# EAGLE schematic ISE2024 kibann (EAGLE 9.6.2)
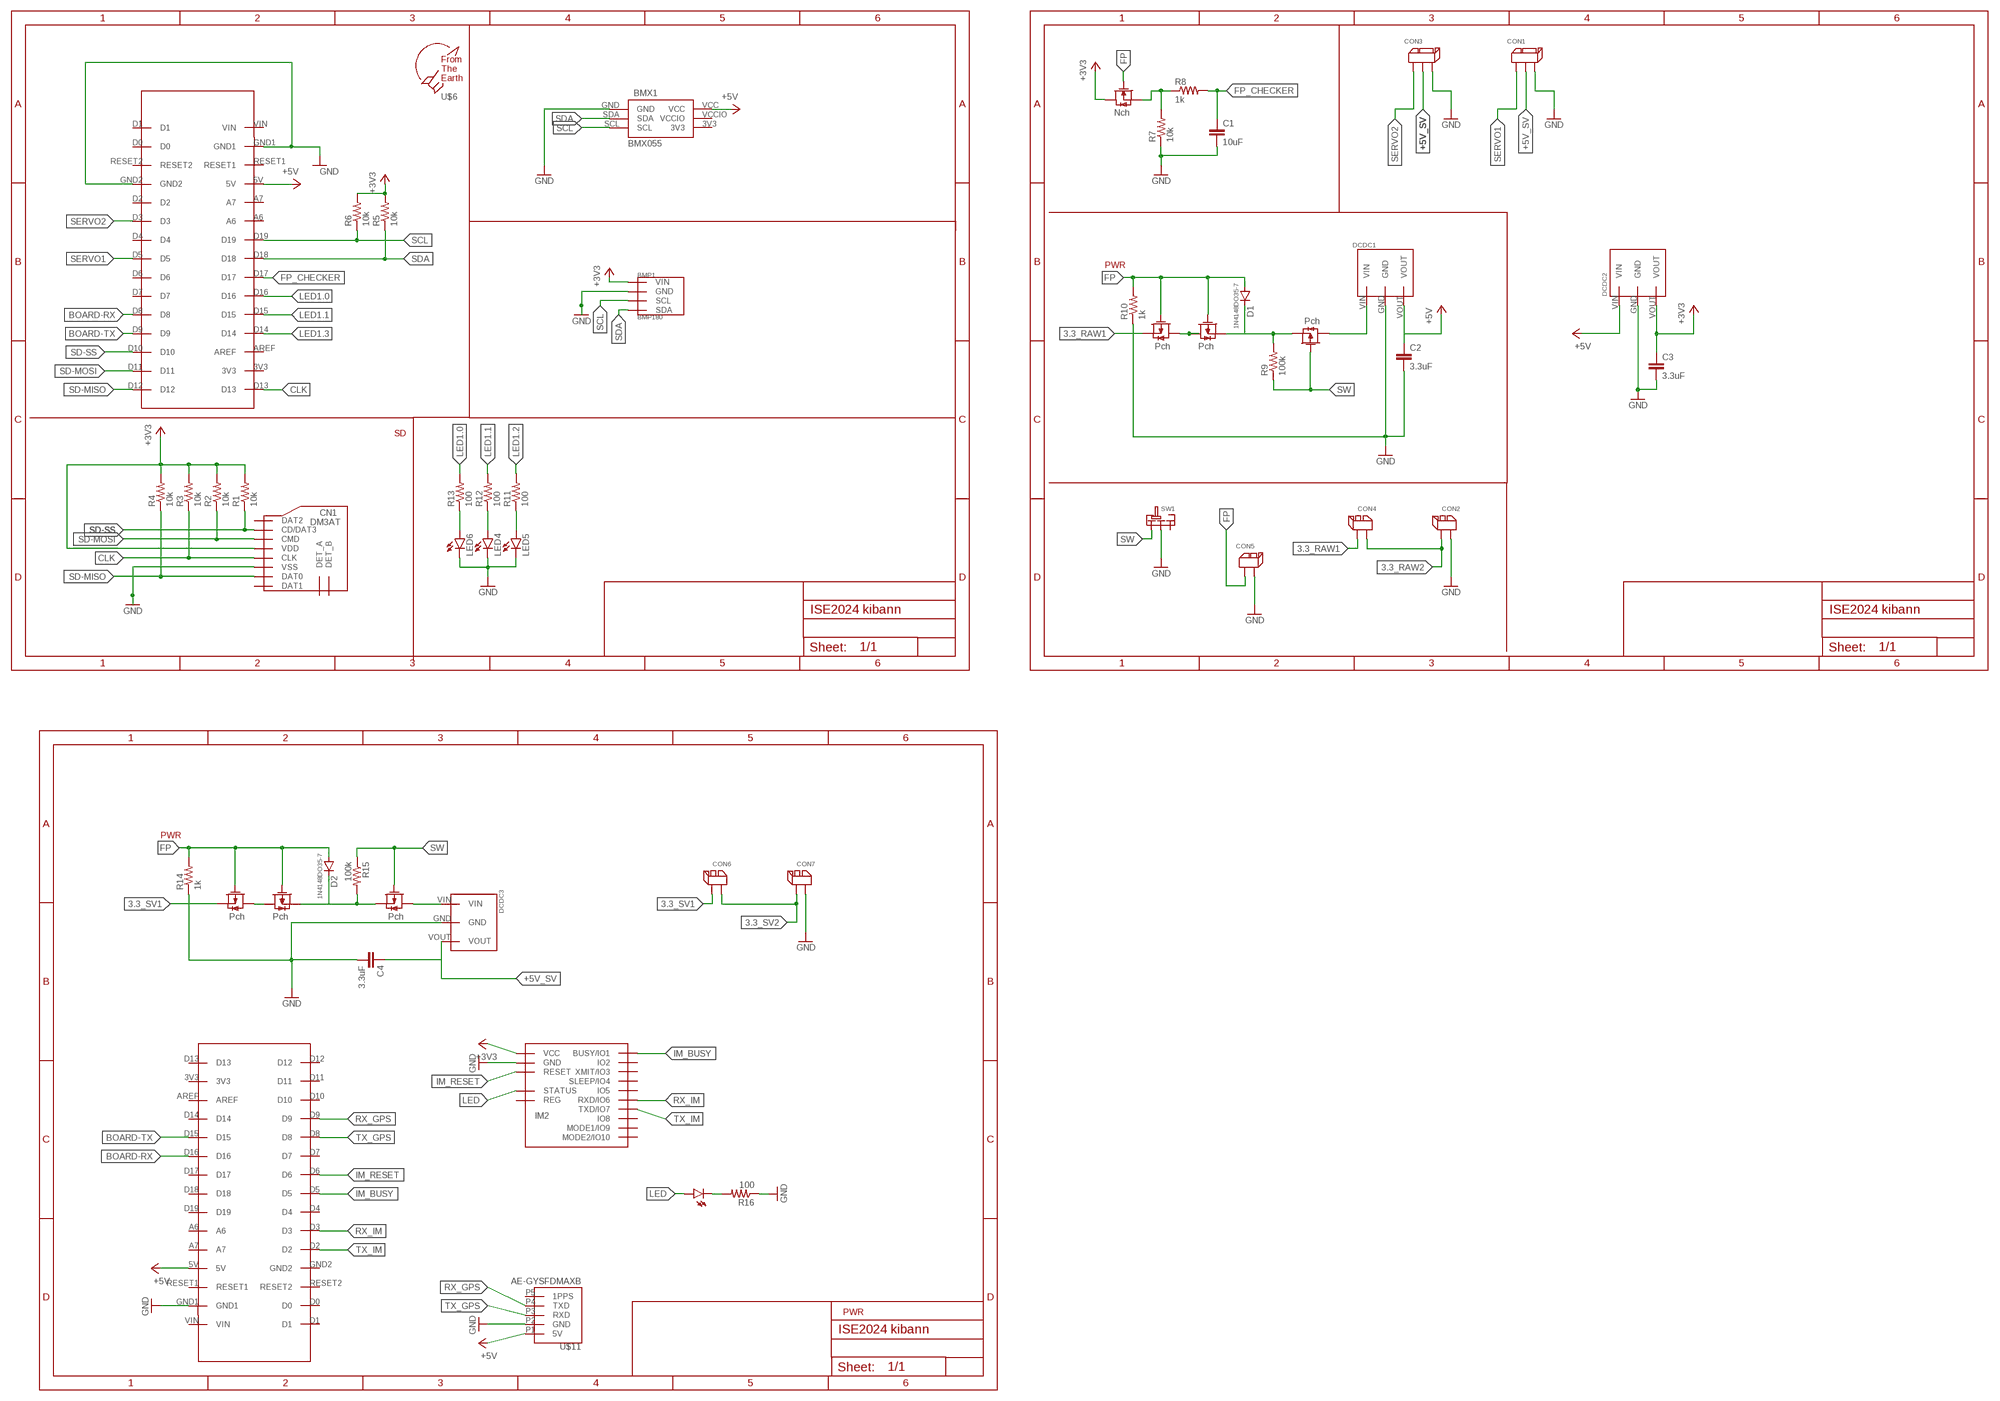
[diagram p0: schematic, sheet 1]

## Parts
BMP1  BMP180  [GY-68]
BMX1  BMX055  [BMX055]
C1  10uF  C-EU025-024X044  [C025-024X044]
C2  3.3uF  C-EU025-024X044  [C025-024X044]
C3  3.3uF  C-EU025-024X044  [C025-024X044]
C4  3.3uF  C-EU025-024X044  [C025-024X044]
CN1  DM3AT  [DM3AT]
CON1  3PIN  [3PIN]
CON2  2PIN  [2PIN]
CON3  3PIN  [3PIN]
CON4  2PIN  [2PIN]
CON5  2PIN  [2PIN]
CON6  2PIN  [2PIN]
CON7  2PIN  [2PIN]
D1  1N4148DO35-7  [DO35-7]
D2  1N4148DO35-7  [DO35-7]
DCDC1  5V1A_M78AR05-1  [5V1A_M78AR05-1]
DCDC2  3.3V1A_M78AR033-1  [3.3V1A_M78AR033-1]
DCDC3  5V1A_M78AR05-1  [5V1A_M78AR05-1]
IM2  IM920_IM920C  [IM920_IM920C]
LED1  LED5MM  [LED5MM]
LED4  LED5MM  [LED5MM]
LED5  LED5MM  [LED5MM]
LED6  LED5MM  [LED5MM]
R1  10k  R-US_0204/7  [0204/7]
R2  10k  R-US_0204/7  [0204/7]
R3  10k  R-US_0204/7  [0204/7]
R4  10k  R-US_0204/7  [0204/7]
R5  10k  R-US_0204/7  [0204/7]
R6  10k  R-US_0204/7  [0204/7]
R7  10k  R-US_0204/7  [0204/7]
R8  1k  R-US_0204/7  [0204/7]
R9  100k  R-US_0204/7  [0204/7]
R10  1k  R-US_0204/7  [0204/7]
R11  100  R-US_0204/7  [0204/7]
R12  100  R-US_0204/7  [0204/7]
R13  100  R-US_0204/7  [0204/7]
R14  1k  R-US_0204/7  [0204/7]
R15  100k  R-US_0204/7  [0204/7]
R16  100  R-US_0204/7  [0204/7]
SW1  SRIDE_SWITCH  [SRIDE_SWITCH]
U$1  ARDUINONANO  [ARDUINONANO]
U$2  2SJ681-PCH  [2SJ681]
U$3  2SK4017-NCH  [2SK4017]
U$4  2SJ681-PCH  [2SJ681]
U$5  2SJ681-PCH  [2SJ681]
U$6  F.T.E.LOGO  [LOGO]
U$7  ARDUINONANO  [ARDUINONANO]
U$8  2SJ681-PCH  [2SJ681]
U$9  2SJ681-PCH  [2SJ681]
U$10  2SJ681-PCH  [2SJ681]
U$11  AE-GYSFDMAXB  [AE-GYSFDMAXB]

## Nets
3.3_RAW1: CON4.P$2 U$2.SOURCE
3.3_RAW2: CON2.P$2 CON4.P$1
3.3_SV1: CON6.P$2 U$8.SOURCE
3.3_SV2: CON6.P$1 CON7.P$2
+3V3: BMP1.P1(VIN) C3.1 CN1.VDD DCDC2.VOUT IM2.$P17(VCC) R1.2 R2.2 R3.2 R4.2 R5.2 R6.2 U$3.DRAIN
+5V: BMX1.VCC C2.1 DCDC1.VOUT DCDC2.VIN U$1.5V U$7.5V
+5V1: DCDC1.VIN U$5.DRAIN
+5V2: DCDC3.VIN U$9.DRAIN
+5V_SV: C4.1 CON1.P$2 CON3.P$2 DCDC3.VOUT
BOARD-RX: U$1.D8 U$7.D16
BOARD-TX: U$1.D9 U$7.D15
CLK: CN1.CLK R3.1 U$1.D13
FP: CON5.P$1 D1.A D2.A R10.2 R14.2 U$2.GATE U$3.GATE U$4.GATE U$8.GATE U$10.GATE
FP_CHECKER: C1.1 R8.2 U$1.D17
GND: BMP1.P2(GND) BMX1.GND C1.2 C2.2 C3.2 C4.2 CN1.VSS CON1.P$3 CON2.P$1 CON3.P$3 CON5.P$2 CON7.P$1 DCDC1.GND DCDC2.GND DCDC3.GND IM2.$P18(GND) LED4.K(C) LED5.K(C) LED6.K(C) R7.1 R10.1 R14.1 R16.1 SW1.LR U$1.GND1 U$1.GND2 U$7.GND1 U$11.P2(GND)
IM_BUSY: IM2.$P1(BUSY/IO1) U$7.D5
IM_RESET: IM2.$P19(RESET) U$7.D6
LED: IM2.$P15(STATUS) LED1.A
LED1.0: R13.2 U$1.D16
LED1.1: R12.2 U$1.D15
LED1.2: R11.2
LED1.3: U$1.D14
N$1: U$2.DRAIN U$4.DRAIN
N$2: LED6.A R13.1
N$3: D1.C R9.2 U$4.SOURCE U$5.SOURCE
N$4: D2.C R15.2 U$9.SOURCE U$10.SOURCE
N$5: U$8.DRAIN U$10.DRAIN
N$6: U$11.P1(5V) ; supply symbol labelled +5V
N$7: LED4.A R12.1
N$8: LED1.K(C) R16.2
N$9: LED5.A R11.1
N$14: R7.2 R8.1 U$3.SOURCE
RX_GPS: U$7.D9 U$11.P4(TXD)
RX_IM: IM2.$P6(RXD/IO6) U$7.D3
SCL: BMP1.P3(SCL) BMX1.SCL R6.1 U$1.D19
SD-MISO: CN1.DAT0 R4.1 U$1.D12
SD-MOSI: CN1.CMD R2.1 U$1.D11
SD-SS: CN1.CD/DAT3 R1.1 U$1.D10
SDA: BMP1.P4(SDA) BMX1.SDA R5.1 U$1.D18
SERVO1: CON1.P$1 U$1.D5
SERVO2: CON3.P$1 U$1.D3
SW: R9.1 R15.1 SW1.L U$5.GATE U$9.GATE
TX_GPS: U$7.D8 U$11.P3(RXD)
TX_IM: IM2.$P7(TXD/IO7) U$7.D2
Unconnected: CN1.DAT1 CN1.DAT2 CN1.DET_A CN1.DET_B IM2.$P2(IO2) IM2.$P3(XMIT/IO3) IM2.$P4(SLEEP/IO4) IM2.$P5(IO5) IM2.$P8(IO8) IM2.$P9(MODE1/IO9) IM2.$P10(MODE2/IO10) IM2.$P16(REG) SW1.R U$1.3V3 U$1.A6 U$1.A7 U$1.AREF U$1.D0 U$1.D1 U$1.D2 U$1.D4 U$1.D6 U$1.D7 U$1.RESET1 U$1.RESET2 U$1.VIN U$7.3V3 U$7.A6 U$7.A7 U$7.AREF U$7.D0 U$7.D1 U$7.D4 U$7.D7 U$7.D10 U$7.D11 U$7.D12 U$7.D13 U$7.D14 U$7.D17 U$7.D18 U$7.D19 U$7.GND2 U$7.RESET1 U$7.RESET2 U$7.VIN U$11.P5(1PPS)

## Notes on the sheet
- PWR
- SD
- PWR
- PWR

## Power pins joined to a net without a drawn wire
3V3: BMX1.3V3
VCCIO: BMX1.VCCIO

## Library data of the parts
BMP1 = BMP180:BMP180
BMX1 = BMX055:BMX055
C1-C4 = rcl:C-EU: CAPACITOR, European symbol; SPICEPREFIX: C
CN1 = microSD:DM3AT
CON1 CON3 = XR Connector:3PIN
CON2 CON4-CON7 = XR Connector:2PIN
D1 D2 = diode:1N4148: DIODE high speed (Philips)
DCDC1 DCDC3 = DC-DC:5V1A_M78AR05-1
DCDC2 = DC-DC:3.3V1A_M78AR033-1
IM2 = CANSAT12th:IM920_IM920C
LED1 LED4-LED6 = led:LED: LED OSRAM: - CHIPLED LG R971, LG N971, LY N971, LG Q971, LY Q971, LO R971, LY R971 LH N974, LH R974 LS Q976, LO Q976, LY Q976 LO Q996 - Hyper CHIPLED LW Q18S LB Q993, LB Q99A, LB R99A - SideLED LS A670, LO A670, LY A670, LG A670, LP A670 LB A673, LV A673, LT A673, LW A673 LH A674 LY A675 LS A676, LA A676, LO A676, LY A676, LW A676 LS A679, LY A679, LG A679 - Hyper Micro SIDELED® LS Y876, LA Y876, LO Y876, LY Y876 LT Y87S - SmartLED LW L88C, LW L88S LB L89C, LB L89S, LG L890 LS L89K, LO L89K, LY L89K LS L896, LA L896, LO L896, LY L896 - TOPLED LS T670, LO T670, LY T670, LG T670, LP T670 LSG T670, LSP T670, LSY T670, LOP T670, LYG T670 LG T671, LOG T671, LSG T671 LB T673, LV T673, LT T673, LW T673 LH T674 LS T676, LA T676, LO T676, LY T676, LB T676, LH T676, LSB T676, LW T676 LB T67C, LV T67C, LT T67C, LS T67K, LO T67K, LY T67K, LW E67C LS E67B, LA E67B, LO E67B, LY E67B, LB E67C, LV E67C, LT E67C LW T67C LS T679, LY T679, LG T679 LS T770, LO T770, LY T770, LG T770, LP T770 LB T773, LV T773, LT T773, LW T773 LH T774 LS E675, LA E675, LY E675, LS T675 LS T776, LA T776, LO T776, LY T776, LB T776 LHGB T686 LT T68C, LB T68C - Hyper Mini TOPLED® LB M676 - Mini TOPLED Santana® LG M470 LS M47K, LO M47K, LY M47K Source: http://www.osram.convergy.de LUXEON: - LUMILED® LXK2-PW12-R00, LXK2-PW12-S00, LXK2-PW14-U00, LXK2-PW14-V00 LXK2-PM12-R00, LXK2-PM12-S00, LXK2-PM14-U00 LXK2-PE12-Q00, LXK2-PE12-R00, LXK2-PE12-S00, LXK2-PE14-T00, LXK2-PE14-U00 LXK2-PB12-K00, LXK2-PB12-L00, LXK2-PB12-M00, LXK2-PB14-N00, LXK2-PB14-P00, LXK2-PB14-Q00 LXK2-PR12-L00, LXK2-PR12-M00, LXK2-PR14-Q00, LXK2-PR14-R00 LXK2-PD12-Q00, LXK2-PD12-R00, LXK2-PD12-S00 LXK2-PH12-R00, LXK2-PH12-S00 LXK2-PL12-P00, LXK2-PL12-Q00, LXK2-PL12-R00 Source: www.luxeon.com KINGBRIGHT: KA-3528ASYC Source: www.kingbright.com
R1-R16 = rcl:R-US_: RESISTOR, American symbol; SPICEPREFIX: R
SW1 = Sride Switch:SRIDE_SWITCH
U$1 U$7 = arduinonano device:ARDUINONANO
U$2 U$4 U$5 U$8-U$10 = mosfet:2SJ681-PCH
U$3 = mosfet:2SK4017-NCH
U$6 = logo:F.T.E.LOGO
U$11 = AE-GYSFDMAXB:AE-GYSFDMAXB

## Net classes
0 default: width 0.406 mm